# Altium schematic sheet Ethernet.SchDoc
size B
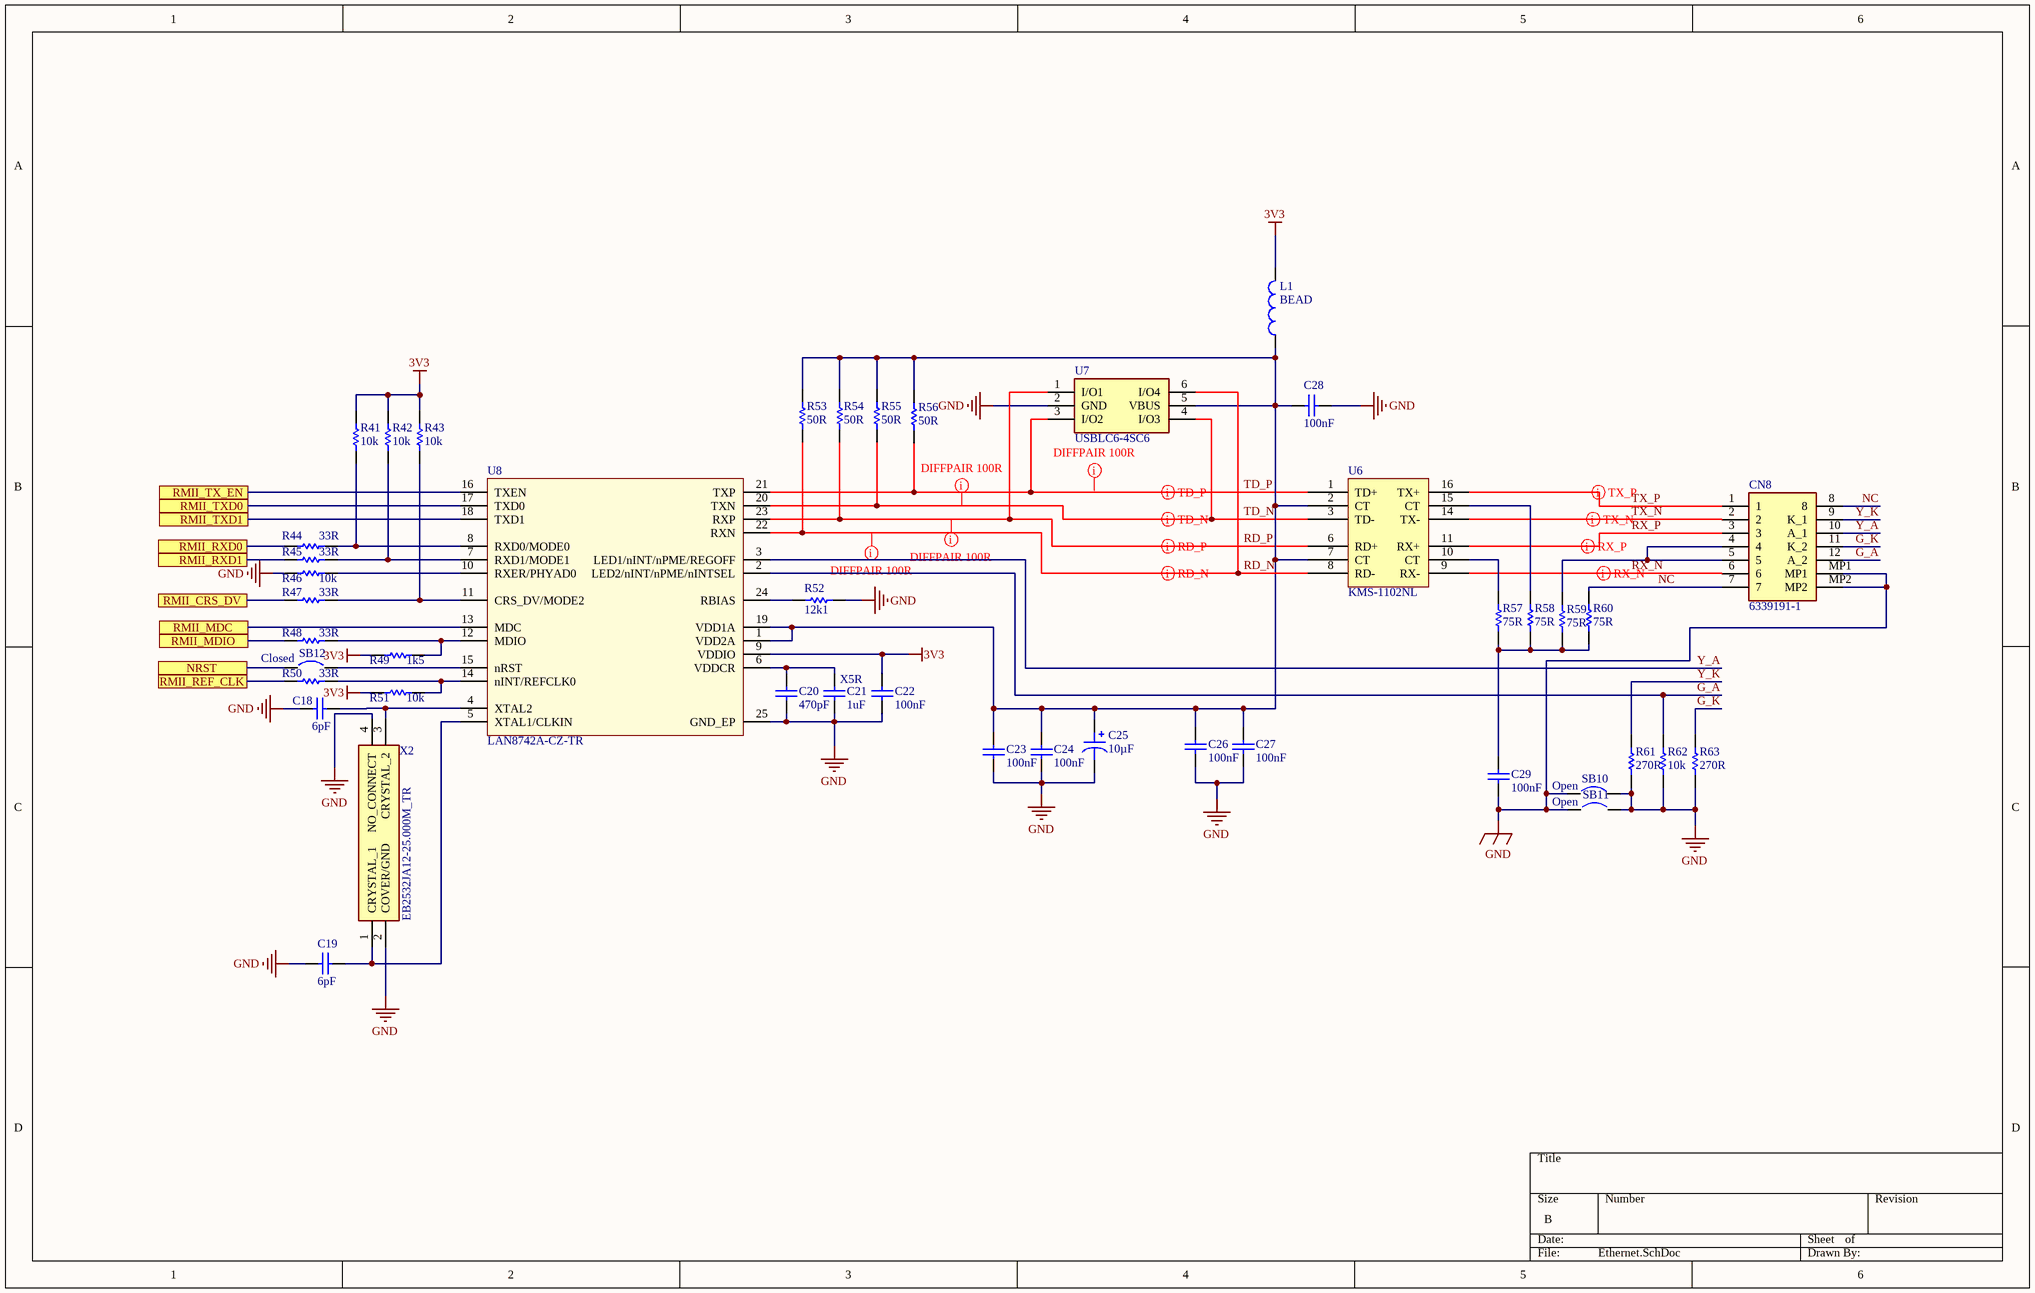
[diagram p0: Ethernet.SchDoc]

## Parts
C18  value 6pF  [1608[0603]]  (hidden comment: Cap)
C19  value 6pF  [1608[0603]]  (hidden comment: Cap)
C20  value 470pF  [1608[0603]]  (hidden comment: Cap)
C21  X5R  value 1uF  [1608[0603]]
C22  value 100nF  [1608[0603]]  (hidden comment: Cap)
C23  value 100nF  [1608[0603]]  (hidden comment: Cap)
C24  value 100nF  [1608[0603]]  (hidden comment: Cap)
C25  10µF  [CAP ALSMD 5.3MM H5.4MM]
C26  value 100nF  [1608[0603]]  (hidden comment: Cap)
C27  value 100nF  [1608[0603]]  (hidden comment: Cap)
C28  value 100nF  [1608[0603]]  (hidden comment: Cap)
C29  value 100nF  [1608[0603]]  (hidden comment: Cap)
CN8  6339191-1  [63391911]
L1  BEAD  [0603L]
R41  value 10k  [1608[0603]]  (hidden comment: Res1)
R42  value 10k  [1608[0603]]  (hidden comment: Res1)
R43  value 10k  [1608[0603]]  (hidden comment: Res1)
R44  value 33R  [1608[0603]]  (hidden comment: Res1)
R45  value 33R  [1608[0603]]  (hidden comment: Res1)
R46  value 10k  [1608[0603]]  (hidden comment: Res1)
R47  value 33R  [1608[0603]]  (hidden comment: Res1)
R48  value 33R  [1608[0603]]  (hidden comment: Res1)
R49  value 1k5  [1608[0603]]  (hidden comment: Res1)
R50  value 33R  [1608[0603]]  (hidden comment: Res1)
R51  value 10k  [1608[0603]]  (hidden comment: Res1)
R52  value 12k1  [1608[0603]]  (hidden comment: Res1)
R53  value 50R  [1608[0603]]  (hidden comment: Res1)
R54  value 50R  [1608[0603]]  (hidden comment: Res1)
R55  value 50R  [1608[0603]]  (hidden comment: Res1)
R56  value 50R  [1608[0603]]  (hidden comment: Res1)
R57  value 75R  [1608[0603]]  (hidden comment: Res1)
R58  value 75R  [1608[0603]]  (hidden comment: Res1)
R59  value 75R  [1608[0603]]  (hidden comment: Res1)
R60  value 75R  [1608[0603]]  (hidden comment: Res1)
R61  value 270R  [1608[0603]]  (hidden comment: Res1)
R62  value 10k  [1608[0603]]  (hidden comment: Res1)
R63  value 270R  [1608[0603]]  (hidden comment: Res1)
SB10  Open  [SB_0603]
SB11  Open  [SB_0603]
SB12  Closed  [SB_0603]
U6  KMS-1102NL  [Transformer]
U7  USBLC6-4SC6  [SOT95P280X145-6N]
U8  LAN8742A-CZ-TR  [QFN24_0R5_4X4]
X2  EB2532JA12-25.000M_TR  [EB2532JA1225000MTR]

## Ports
NRST, RMII_CRS_DV, RMII_MDC, RMII_MDIO, RMII_REF_CLK, RMII_RXD0, RMII_RXD1, RMII_TX_EN, RMII_TXD0, RMII_TXD1

## Nets
3V3: C22.1 L1.2 R41.2 R42.2 R43.2 R49.2 R51.2 U8.9(VDDIO)
GND: C18.1 C19.1 C20.2 C21.2 C22.2 C23.2 C24.2 C25.2 C26.2 C27.2 C28.1 C29.1 CN8.MP1 CN8.MP2 R46.2 R52.1 R61.1 R62.1 R63.1 SB10.1 SB10.2 SB11.1 SB11.2 U7.2(GND) U8.25(GND_EP) X2.2(COVER/GND) X2.4(NO_CONNECT)
G_A: CN8.12(A_2) R62.2 U8.2(LED2/nINT/nPME/nINTSEL)
G_K: CN8.11(K_2) R63.2
NC: CN8.7 CN8.8 R60.2
NRST: SB12.1 ; port NRST
RD_N: R53.1 U6.8(RD-) U7.6(I/O4) U8.22(RXN)
RD_P: R54.1 U6.6(RD+) U7.1(I/O1) U8.23(RXP)
RMII_CRS_DV: R47.2 ; port RMII_CRS_DV
RMII_MDC: U8.13(MDC) ; port RMII_MDC
RMII_MDIO: R48.2 ; port RMII_MDIO
RMII_REF_CLK: R50.2 ; port RMII_REF_CLK
RMII_RXD0: R44.2 ; port RMII_RXD0
RMII_RXD1: R45.2 ; port RMII_RXD1
RMII_TX_EN: U8.16(TXEN) ; port RMII_TX_EN
RMII_TXD0: U8.17(TXD0) ; port RMII_TXD0
RMII_TXD1: U8.18(TXD1) ; port RMII_TXD1
RX_N: CN8.6 U6.9(RX-)
RX_P: CN8.3 U6.11(RX+)
TD_N: R55.1 U6.3(TD-) U7.4(I/O3) U8.20(TXN)
TD_P: R56.1 U6.1(TD+) U7.3(I/O2) U8.21(TXP)
TX_N: CN8.2 U6.14(TX-)
TX_P: CN8.1 U6.16(TX+)
Y_A: CN8.10(A_1) U8.3(LED1/nINT/nPME/REGOFF)
Y_K: CN8.9(K_1) R61.2
NetC18_2: C18.2 U8.4(XTAL2) X2.3(CRYSTAL_2)
NetC19_2: C19.2 U8.5(XTAL1/CLKIN) X2.1(CRYSTAL_1)
NetC20_1: C20.1 C21.1 U8.6(VDDCR)
NetC23_1: C23.1 C24.1 C25.1 C26.1 C27.1 C28.2 L1.1 R53.2 R54.2 R55.2 R56.2 U6.2(CT) U6.7(CT) U7.5(VBUS) U8.1(VDD2A) U8.19(VDD1A)
NetC29_2: C29.2 R57.1 R58.1 R59.1 R60.1
NetCN8_4: CN8.4 CN8.5 R59.2
NetR41_1: R41.1 R44.1 U8.8(RXD0/MODE0)
NetR42_1: R42.1 R45.1 U8.7(RXD1/MODE1)
NetR43_1: R43.1 R47.1 U8.11(CRS_DV/MODE2)
NetR46_1: R46.1 U8.10(RXER/PHYAD0)
NetR48_1: R48.1 R49.1 U8.12(MDIO)
NetR50_1: R50.1 R51.1 U8.14(nINT/REFCLK0)
NetR52_2: R52.2 U8.24(RBIAS)
NetR57_2: R57.2 U6.10(CT)
NetR58_2: R58.2 U6.15(CT)
NetSB12_2: SB12.2 U8.15(nRST)

## Layout directives
differential pair: RD_N, RD_P, RX_N, RX_P, TD_N, TD_P, TX_N, TX_P
mark named DIFFPAIR 100R: (no net found under the mark), RD_N, RD_P, TD_N

## Library data of the parts
C18-C24 C26-C29 = Cap: Capacitor; Published: 8-Jun-2000; LatestRevisionDate: 17-Jul-2002; LatestRevisionNote: Re-released for DXP Platform.; PackageReference: RAD-0.3; Publisher: Altium Limited; PackageDescription: Radial Cap, Thru-Hole; 2 Leads; 0.3 in Pin Spacing
C25 = UZP1C100MCL1GB: CAP ALUM 10UF 20% 16V SMD; manufacturer: Nichicon; Lifetime @ Temp.: 2000 Hrs @ 85°C; Polarization: Bi-Polar; Ripple Current @ High Frequency: 34.5mA @ 10kHz; Ripple Current @ Low Frequency: 23mA @ 120Hz; Surface Mount Land Size: 0.209" L x 0.209" W (5.30mm x 5.30mm); Part Number: UZP1C100MCL1GB; Applications: General Purpose; Capacitance: 10µF; componentlink1description: Datasheet; componentlink1url: //media.digikey.com/pdf/Data%20Sheets/Nichicon%20PDFs/ZP_Series.pdf; componentlink2description: DigiKey Link; componentlink2url: http://digikey.com/product-detail/en/nichicon/UZP1C100MCL1GB/493-10077-1-ND/3983922; Device Package: Radial, Can - SMD; Height - Seated (Max): 0.181" (4.60mm); lastupdated: 9/2/2020 1:18:30 AM; Lifecycle Status: Active; Minimum Order: 1; Mounting Type: Surface Mount; Operating Temperature: -40°C ~ 85°C; Package / Case: Radial, Can - SMD; packaging: TapeAndReel; partid: 8608; Part Status: Active; price: 0.21; series: UZP; Size / Dimension: 0.197" Dia (5.00mm); Supplier 1: DigiKey; Supplier Part Number 1: 493-10077-1-ND; Tolerance: ±20%; value: 10µF; Voltage - Rated: 16V
CN8 = 6339191-1: Connector; Manufacturer_Name: TE Connectivity; Datasheet Link: http://www.te.com/commerce/DocumentDelivery/DDEController?Action=srchrtrv&DocNm=6339191&DocType=Customer+Drawing&DocLang=English&DocFormat=pdf&PartCntxt=6339191-1; Height: 14.91mm; Manufacturer_Part_Number: 6339191-1; Mouser Part Number: 571-6339191-1; Mouser Price/Stock: https://www.mouser.co.uk/ProductDetail/TE-Connectivity-AMP/6339191-1?qs=6KRng%2F8lLtNwkkppUOlXgw%3D%3D; Arrow Part Number: 6339191-1; Arrow Price/Stock: https://www.arrow.com/en/products/6339191-1/te-connectivity?region=europe
L1 = Inductor: Value: 100uH; Published: 8-Jun-2000; Revision: July-2002: Re-released for DXP Platform.; Publisher: Altium Limited
R41-R63 = Res1: Resistor; Published: 8-Jun-2000; LatestRevisionDate: 17-Jul-2002; LatestRevisionNote: Re-released for DXP Platform.; PackageReference: AXIAL-0.3; Publisher: Altium Limited; PackageDescription: Axial Device, Thru-Hole; 2 Leads; 0.3 in Pin Spacing
SB10-SB12 = Circuit Breaker: Published: 24-Mar-1999; Revision: July-2002: Re-released for DXP Platform.; Publisher: Altium Limited
U7 = USBLC6-4SC6: Integrated Circuit; Manufacturer_Name: STMicroelectronics; Datasheet Link: http://www.st.com/st-web-ui/static/active/en/resource/technical/document/datasheet/CD00047494.pdf; Height: 1.45mm; Manufacturer_Part_Number: USBLC6-4SC6; Mouser Part Number: 511-USBLC6-4SC6; Mouser Price/Stock: https://www.mouser.co.uk/ProductDetail/STMicroelectronics/USBLC6-4SC6?qs=k9dH%2Fx4GHJCNdehb8zInZg%3D%3D; Arrow Part Number: USBLC6-4SC6; Arrow Price/Stock: https://www.arrow.com/en/products/usblc6-4sc6/stmicroelectronics?region=nac
U8 = LAN8742A-CZ-TR: LAN8742A-CZ-TR - Small Footprint RMII 10/100 Ethernet, Transceiver with HP Auto-MDIX and flexPWR Technology SQFN-24; Manuf_1: MICROCHIP; Order: LAN8742A-CZ-TR; Manuf_Part_1: LAN8742A-CZ-TR; Distrib: MICROCHIP
X2 = EB2532JA12-25.000M_TR: Crystal or Oscillator; Manufacturer_Name: Ecliptek; Manufacturer_Part_Number: EB2532JA12-25.000M TR; Datasheet Link: https://componentsearchengine.com/Datasheets/1/EB2532JA12-25.000M TR.pdf; Height: 0.8mm; Mouser Part Number: 669-EB2532JA12-25T; Mouser Price/Stock: https://www.mouser.com/Search/Refine.aspx?Keyword=669-EB2532JA12-25T; Arrow Part Number: EB2532JA12-25.000M TR; Arrow Price/Stock: https://www.arrow.com/en/products/eb2532ja12-25.000m-tr/ecliptek